# Altium schematic sheet Top-Level.SchDoc: Top-Level
size A3; CompanyName: Novelda AS; Organization: Novelda AS; Address1: Gjerdrums vei 8; Address2: NO-0484 Oslo; Address3: Norway; Revision: 1.A; SheetNumber: 1; SheetTotal: 2; Classification: Public; Size: A3; Project: X4M01; ProjectName: Prosject Name
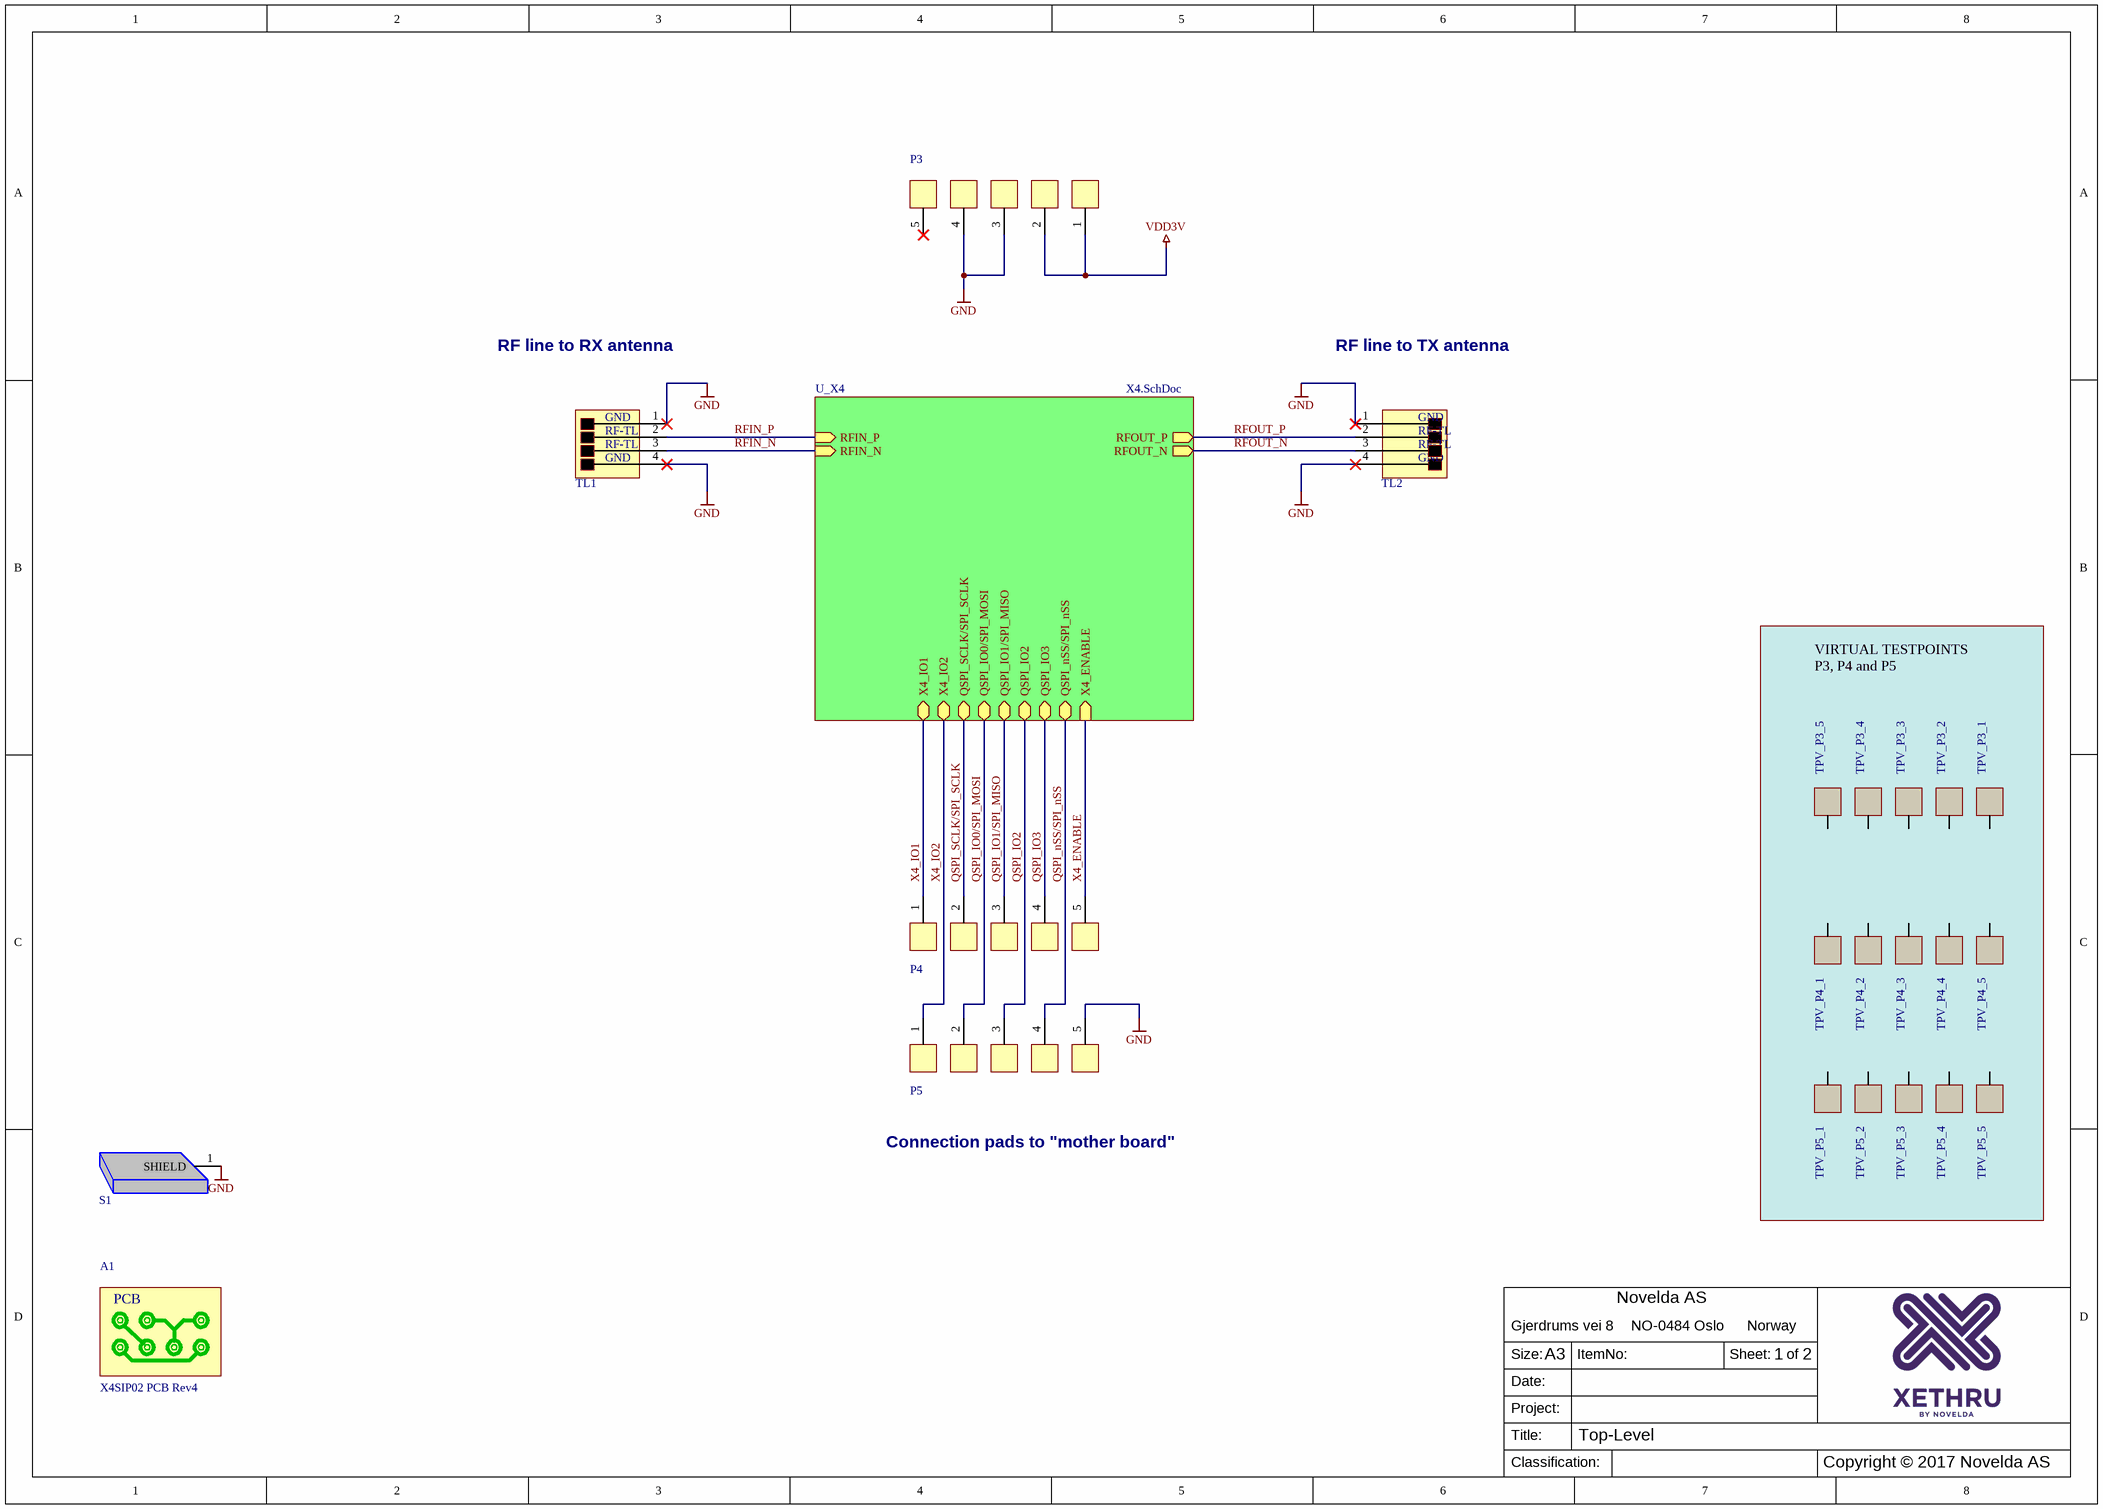
[diagram p0: Top-Level.SchDoc]

## Parts
A1  X4SIP02 PCB Rev4  (mechanical)
P3  5x CONNECTION PADS  [ALTIUM-0024]  (value not drawn)  (no BOM)
P4  5x CONNECTION PADS  [ALTIUM-0024]  (value not drawn)  (no BOM)
P5  5x CONNECTION PADS  [ALTIUM-0024]  (value not drawn)  (no BOM)
S1  Shield box  [200284-003]  (value not drawn)
TL1  X4SIP RF TRANSMISSION LINE  (value not drawn)  (graphical)
TL2  X4SIP RF TRANSMISSION LINE  (value not drawn)  (graphical)
TPV_P3_1  TPV  (value not drawn)  (graphical)
TPV_P3_2  TPV  (value not drawn)  (graphical)
TPV_P3_3  TPV  (value not drawn)  (graphical)
TPV_P3_4  TPV  (value not drawn)  (graphical)
TPV_P3_5  TPV  (value not drawn)  (graphical)
TPV_P4_1  TPV  (value not drawn)  (graphical)
TPV_P4_2  TPV  (value not drawn)  (graphical)
TPV_P4_3  TPV  (value not drawn)  (graphical)
TPV_P4_4  TPV  (value not drawn)  (graphical)
TPV_P4_5  TPV  (value not drawn)  (graphical)
TPV_P5_1  TPV  (value not drawn)  (graphical)
TPV_P5_2  TPV  (value not drawn)  (graphical)
TPV_P5_3  TPV  (value not drawn)  (graphical)
TPV_P5_4  TPV  (value not drawn)  (graphical)
TPV_P5_5  TPV  (value not drawn)  (graphical)

## Sub-sheets
U_X4 = X4.SchDoc: X4_ENABLE (in), X4_IO1 (bidir), X4_IO2 (bidir), RFIN_P (in), RFOUT_N (out), RFIN_N (in), RFOUT_P (out), QSPI_IO0/SPI_MOSI (bidir), QSPI_IO1/SPI_MISO (bidir), QSPI_IO2 (bidir), QSPI_IO3 (bidir), QSPI_nSS/SPI_nSS (bidir), QSPI_SCLK/SPI_SCLK (bidir)

## Nets
GND: P3.3 P3.4 P5.5 S1.1(SHIELD) TL1.1(GND) TL1.4(GND) TL2.1(GND) TL2.4(GND)
VDD3V: P3.1 P3.2
QSPI_IO0/SPI_MOSI: P5.2 ; sheet U_X4/QSPI_IO0/SPI_MOSI
QSPI_IO1/SPI_MISO: P4.3 ; sheet U_X4/QSPI_IO1/SPI_MISO
QSPI_IO2: P5.3 ; sheet U_X4/QSPI_IO2
QSPI_IO3: P4.4 ; sheet U_X4/QSPI_IO3
QSPI_nSS/SPI_nSS: P5.4 ; sheet U_X4/QSPI_nSS/SPI_nSS
QSPI_SCLK/SPI_SCLK: P4.2 ; sheet U_X4/QSPI_SCLK/SPI_SCLK
RFIN_N: TL1.3(RF_N) ; sheet U_X4/RFIN_N
RFIN_P: TL1.2(RF_P) ; sheet U_X4/RFIN_P
RFOUT_N: TL2.3(RF_N) ; sheet U_X4/RFOUT_N
RFOUT_P: TL2.2(RF_P) ; sheet U_X4/RFOUT_P
X4_ENABLE: P4.5 ; sheet U_X4/X4_ENABLE
X4_IO1: P4.1 ; sheet U_X4/X4_IO1
X4_IO2: P5.1 ; sheet U_X4/X4_IO2

Not connected (* = marked no-connect by the designer): P3 5*; TPV_P3_1 1; TPV_P3_2 1; TPV_P3_3 1; TPV_P3_4 1; TPV_P3_5 1; TPV_P4_1 1; TPV_P4_2 1; TPV_P4_3 1; TPV_P4_4 1; TPV_P4_5 1; TPV_P5_1 1; TPV_P5_2 1; TPV_P5_3 1; TPV_P5_4 1; TPV_P5_5 1

## Notes on the sheet
- RF line to RX antenna
- RF line to TX antenna
- VIRTUAL TESTPOINTS
  P3, P4 and P5
- Connection pads to "mother board"
- Size:
- Date:
- ItemNo:
- Sheet:
- of
- Title:
- Project:
- Classification:
- Copyright © 2017 Novelda AS
- (in symbol ALTIUM-0020) RF-TL

## Library data of the parts
A1 = 290047-004: Manufacturer: Novelda; Component Status: New; ItemNo: 290047-004; Value: X4SIP02 PCB Rev4; Component Category: PCB; MPN: 290047-004; ClassName: -; Notes: -
P3-P5 = ALTIUM-0024: SMD CONNECTION PADS, 5, 0.6x0.6mm, 2mm PITCH; Component Status: Active; Component Category: Misc; ItemNo: ALTIUM-0024; Value: 5x CONNECTION PADS; Manufacturer: --; ClassName: -; Notes: -
S1 = 200284-003: Shieldbox 14.2 x 12.2 x 3mm; Component Status: New; Component Category: Misc; ItemNo: 200284-003; Value: Shield box; Manufacturer: --; MPN: -; ClassName: -; Notes: -
TL1 TL2 = ALTIUM-0020: Component Status: Active; Component Category: Antenna; ItemNo: ALTIUM-0020; Value: X4SIP RF TRANSMISSION LINE; Manufacturer: --; ClassName: -; Notes: -
TPV_P3_1-TPV_P3_5 TPV_P4_1-TPV_P4_5 TPV_P5_1-TPV_P5_5 = ALTIUM-0007: TESTPOINT, Virtual, Only on schematic, Used when actual testpoint is other component pins.; Component Status: Active; Component Category: Misc; ItemNo: ALTIUM-0007; Value: TPV; ClassName: Testpoint; Notes: -; TP_Type: -; TP_LegalValueRange: -; TP_Notes: -